# EAGLE design smd_isp adapters (EAGLE 6.1)
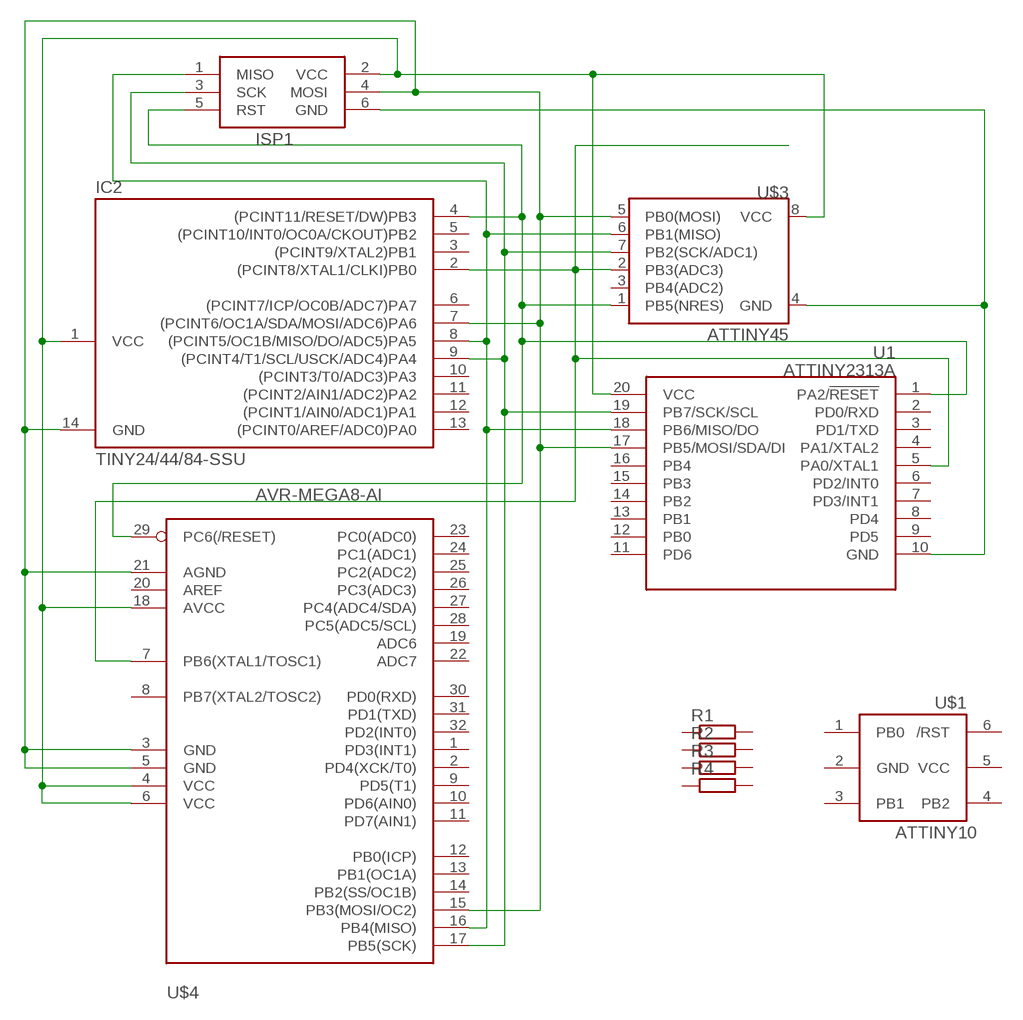
[diagram p0: schematic, sheet 1]

## Parts
IC2  TINY24/44/84-SSU  [SOIC14]
ISP1  AVRISP-6  [AVRISP]
R1  R-EU_R0805  [R0805]
R2  R-EU_R0805  [R0805]
R3  R-EU_R0805  [R0805]
R4  R-EU_R0805  [R0805]
U1  ATTINY2313A  [SOP20W]
U$1  ATTINY10  [SOT23-6]
U$3  ATTINY45  [SO08-EIAJ]
U$4  AVR-MEGA8-AI  [TQFP32-08]

## Nets
MISO: IC2.8((PCINT5/OC1B/MISO/DO/ADC5)PA5) ISP1.1(MISO) U1.18(PB6/MISO/DO) U$3.6(PB1(MISO)) U$4.16(PB4(MISO))
MOSI: IC2.7((PCINT6/OC1A/SDA/MOSI/ADC6)PA6) IC2.14(GND) ISP1.4(MOSI) U1.17(PB5/MOSI/SDA/DI) U$3.5(PB0(MOSI)) U$4.3(GND) U$4.5(GND) U$4.15(PB3(MOSI/OC2)) U$4.21(AGND)
N$1: IC2.2((PCINT8/XTAL1/CLKI)PB0) U1.5(PA0/XTAL1) U$3.2(PB3(ADC3)) U$4.7(PB6(XTAL1/TOSC1))
N$2: ISP1.6(GND) U1.10(GND) U$3.4(GND)
N$3: IC2.1(VCC) ISP1.2(VCC) U1.20(VCC) U$3.8(VCC) U$4.4(VCC) U$4.6(VCC) U$4.18(AVCC)
RST: IC2.4((PCINT11/RESET/DW)PB3) ISP1.5(RST) U1.1(PA2/!RESET) U$3.1(PB5(NRES)) U$4.29(PC6(/RESET))
SCK: IC2.9((PCINT4/T1/SCL/USCK/ADC4)PA4) ISP1.3(SCK) U1.19(PB7/SCK/SCL) U$3.7(PB2(SCK/ADC1)) U$4.17(PB5(SCK))
Unconnected: IC2.3((PCINT9/XTAL2)PB1) IC2.5((PCINT10/INT0/OC0A/CKOUT)PB2) IC2.6((PCINT7/ICP/OC0B/ADC7)PA7) IC2.10((PCINT3/T0/ADC3)PA3) IC2.11((PCINT2/AIN1/ADC2)PA2) IC2.12((PCINT1/AIN0/ADC1)PA1) IC2.13((PCINT0/AREF/ADC0)PA0) R1.1 R1.2 R2.1 R2.2 R3.1 R3.2 R4.1 R4.2 U1.2(PD0/RXD) U1.3(PD1/TXD) U1.4(PA1/XTAL2) U1.6(PD2/INT0) U1.7(PD3/INT1) U1.8(PD4) U1.9(PD5) U1.11(PD6) U1.12(PB0) U1.13(PB1) U1.14(PB2) U1.15(PB3) U1.16(PB4) U$1.1(PB0) U$1.3(PB1) U$1.4(PB2) U$1.6(/RST) U$3.3(PB4(ADC2)) U$4.1(PD3(INT1)) U$4.2(PD4(XCK/T0)) U$4.8(PB7(XTAL2/TOSC2)) U$4.9(PD5(T1)) U$4.10(PD6(AIN0)) U$4.11(PD7(AIN1)) U$4.12(PB0(ICP)) U$4.13(PB1(OC1A)) U$4.14(PB2(SS/OC1B)) U$4.19(ADC6) U$4.20(AREF) U$4.22(ADC7) U$4.23(PC0(ADC0)) U$4.24(PC1(ADC1)) U$4.25(PC2(ADC2)) U$4.26(PC3(ADC3)) U$4.27(PC4(ADC4/SDA)) U$4.28(PC5(ADC5/SCL)) U$4.30(PD0(RXD)) U$4.31(PD1(TXD)) U$4.32(PD2(INT0))

## Power pins joined to a net without a drawn wire
GND: U$1.2(GND)
VCC: U$1.5(VCC)

## Library data of the parts
IC2 = avr-5:TINY24/44/84
ISP1 = adafruit:AVRISP: AVR ISP HEADER Standard 6 pin header for AVR programming
R1-R4 = rcl:R-EU_: RESISTOR, European symbol
U1 = SparkFun-DigitalIC:ATTINY2313A: ATTINY2313A 2kB 20MHz I2C/SPI/UART; PROD_ID: IC-11305
U$1 = adafruit_t10:ATTINY10: ATtiny4/5/9/10 8-bit Microcontroller with 512/1024 Bytes In-System Programmable Flash
U$3 = SparkFun:ATTINY45: Atmel ATTiny45
U$4 = SparkFun-DigitalIC:AVR-MEGA8: MICROCONTROLLER 8 Kbytes FLASH 1 kbytes SRAM 512 bytes EEPROM USART 6-channel 10 bit ADC 2-channel 8 bit ADC

## Board
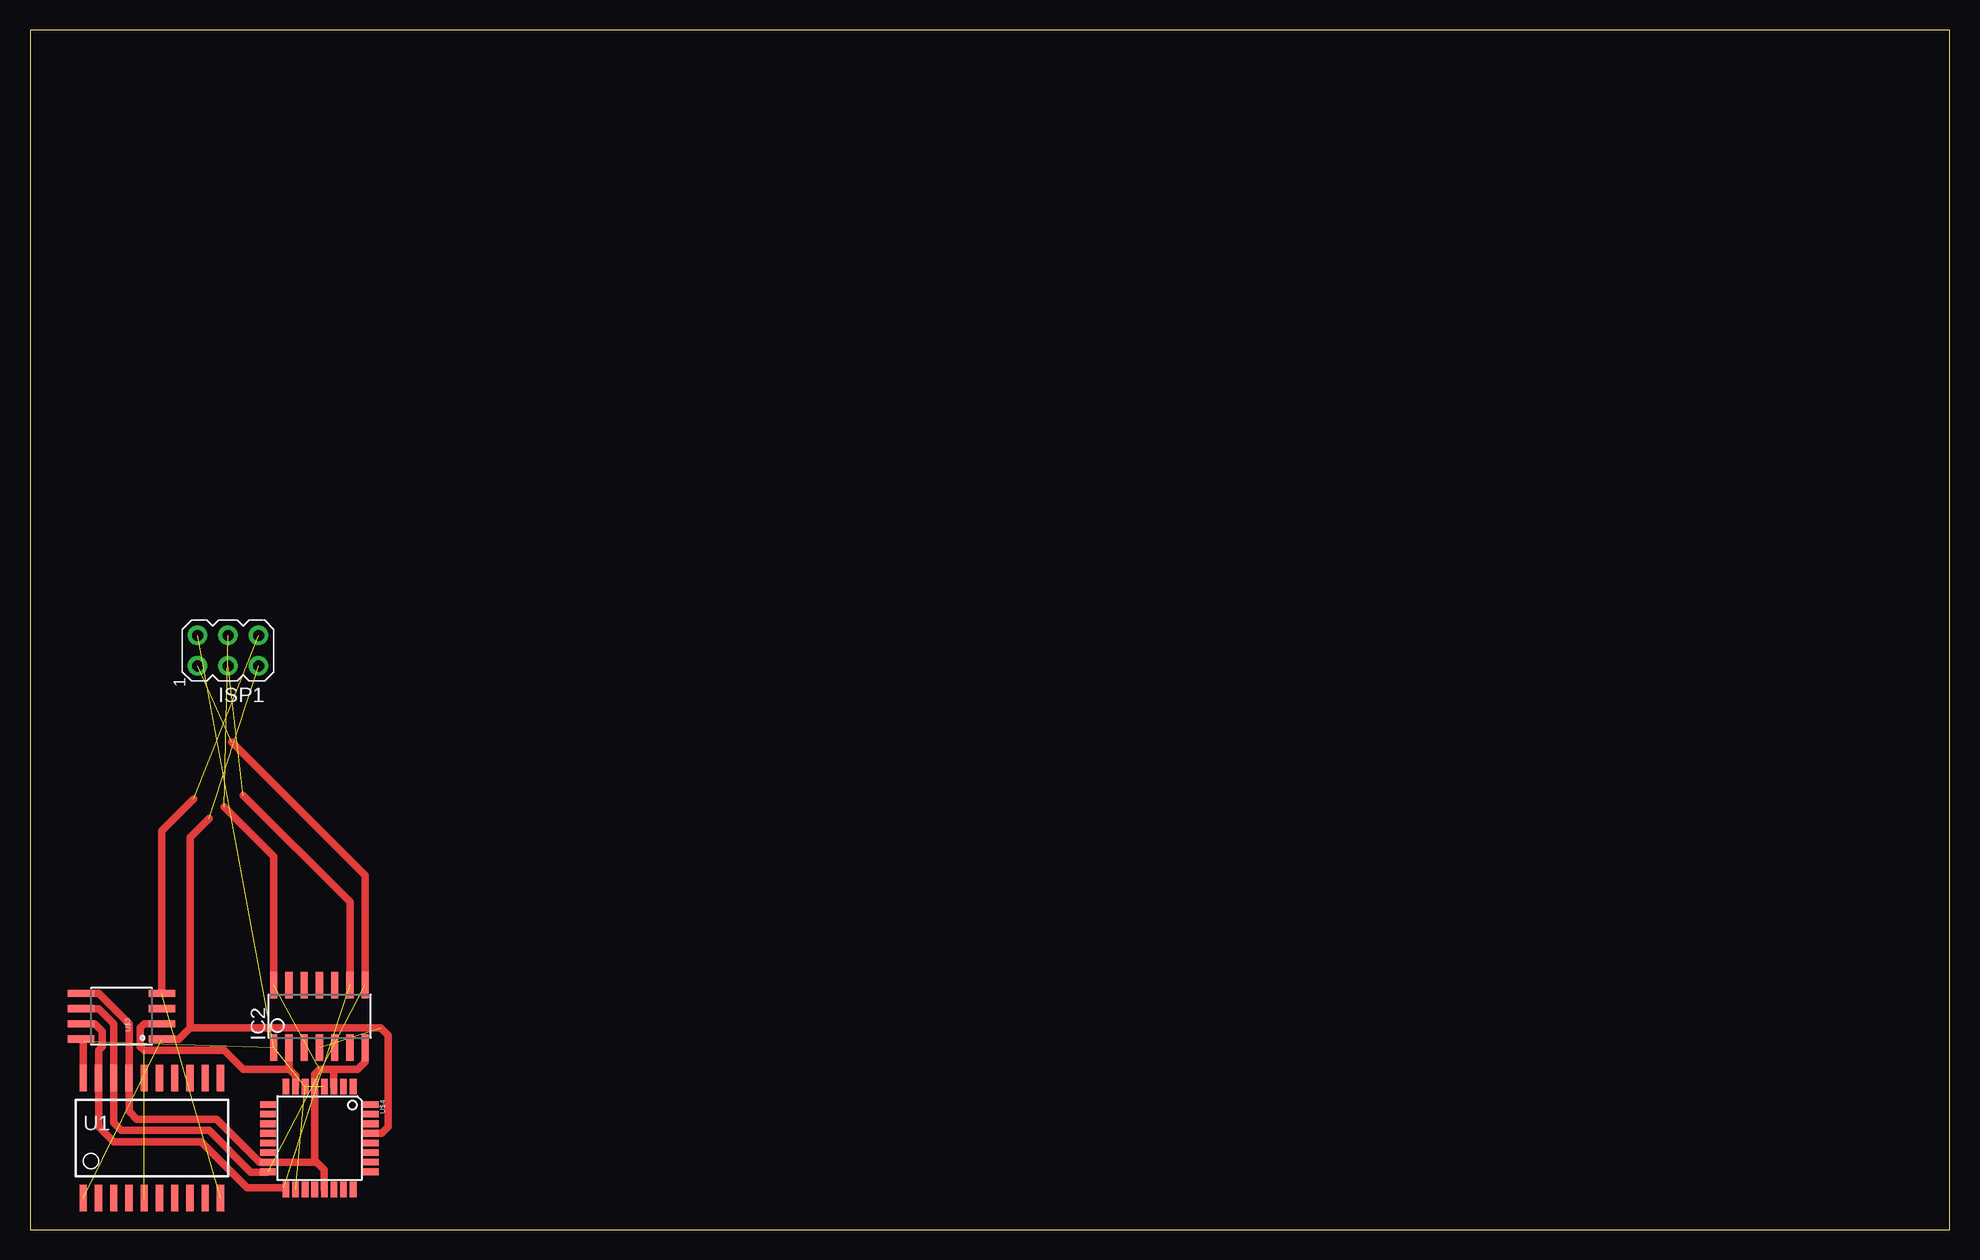
[diagram p1: board, top side]

Size 160 x 100 mm. Coordinates in mm from the lower left corner, seen from the top.
Outline: 0,0 160,0 160,100 0,100 0,0
Copper layers (1*16): Top 0.035mm / dielectric 1.5mm / Bottom 0.035mm
Design rules: minimum track width 10mil, minimum drill 24mil, track to track 8mil, track to pad 8mil, pad to pad 8mil, via to via 8mil, smd to smd 8mil, copper to edge 40mil, drill to drill 8mil, minimum pad ring 10mil, minimum via ring 8mil, stop-mask expansion 4mil, vias tented up to drill 0mil, thermal gap 10mil

### Footprints (pad centres in the part's own frame; a part is rotated, then mirrored left to right if it is on the bottom)
SOIC14 = smd 0.61 x 2.21: 1 -3.81,-2.603; 2 -2.54,-2.603; 3 -1.27,-2.603; 4 0,-2.603; 5 1.27,-2.603; 6 2.54,-2.603; 7 3.81,-2.603; 8 3.81,2.603; 9 2.54,2.603; 10 1.27,2.603; 11 0,2.603; 12 -1.27,2.603; 13 -2.54,2.603; 14 -3.81,2.603
AVRISP = drill 0.9 pad 1.626: 1 -1.27,2.54; 2 1.27,2.54; 3 -1.27,0; 4 1.27,0; 5 -1.27,-2.54; 6 1.27,-2.54
R0805 = smd 1.3 x 1.5: 1 -0.95,0; 2 0.95,0
SOP20W = smd 0.6 x 2.2: 1 -5.715,-5; 2 -4.445,-5; 3 -3.175,-5; 4 -1.905,-5; 5 -0.635,-5; 6 0.635,-5; 7 1.905,-5; 8 3.175,-5; 9 4.445,-5; 10 5.715,-5; 11 5.715,5; 12 4.445,5; 13 3.175,5; 14 1.905,5; 15 0.635,5; 16 -0.635,5; 17 -1.905,5; 18 -3.175,5; 19 -4.445,5; 20 -5.715,5
SOT23-6 = smd 0.55 x 1.2: 1 -0.95,-1.3; 2 0,-1.3; 3 0.95,-1.3; 4 0.95,1.3; 5 0,1.3; 6 -0.95,1.3
SO08-EIAJ = smd 0.61 x 2.21: 1 -1.905,-3.378; 2 -0.635,-3.378; 3 0.635,-3.378; 4 1.905,-3.378; 5 1.905,3.353; 6 0.635,3.353; 7 -0.635,3.353; 8 -1.905,3.353
TQFP32-08 = smd 1.27 x 0.559: 1 -4.293,2.8; 2 -4.293,2; 3 -4.293,1.2; 4 -4.293,0.4; 5 -4.293,-0.4; 6 -4.293,-1.2; 7 -4.293,-2; 8 -4.293,-2.8; 17 4.293,-2.8; 18 4.293,-2; 19 4.293,-1.2; 20 4.293,-0.4; 21 4.293,0.4; 22 4.293,1.2; 23 4.293,2; 24 4.293,2.8 | smd 0.559 x 1.27: 9 -2.8,-4.293; 10 -2,-4.293; 11 -1.2,-4.293; 12 -0.4,-4.293; 13 0.4,-4.293; 14 1.2,-4.293; 15 2,-4.293; 16 2.8,-4.293; 25 2.8,4.293; 26 2,4.293; 27 1.2,4.293; 28 0.4,4.293; 29 -0.4,4.293; 30 -1.2,4.293; 31 -2,4.293; 32 -2.8,4.293

### Placement (x,y rotation side)
IC2  24.13,17.78 0 top
ISP1  16.51,48.26 90 top
R1  -53.34,-3.81 0 top  (outside the outline)
R2  -53.34,-8.89 0 top  (outside the outline)
R3  -53.34,-13.97 0 top  (outside the outline)
R4  -53.34,-19.05 0 top  (outside the outline)
U1  10.16,7.62 0 top
U$1  -20.32,38.1 0 top  (outside the outline)
U$3  7.62,17.78 90 top
U$4  24.13,7.62 270 top

### Tracks (layer width: path | path; a pad name or v marks a point on that pad's centre or on a via)
MISO  (2 unrouted)
  Top 0.61: U$3.6 5.71,18.41 6.99,17.14 U1.18 6.99,8.89 7.62,8.26 14.92,8.26 18.41,4.76 19.78,4.76 U$4.16 | IC2.8 27.94,29.53 16.83,40.64
MOSI  (2 unrouted)
  Top 0.61: IC2.7 27.94,13.97 27.3,13.34 25.4,13.34 | 25.4,13.34 24.13,13.34 23.73,12.94 U$4.5 23.73,5.62 | U$4.3 25.33,13.27 25.4,13.34 | U$3.5 5.71,19.68 8.26,17.14 U1.17 8.26,9.84 8.89,9.21 15.56,9.21 19.14,5.62 U$4.15 23.73,5.62 | 23.73,5.62 23.91,5.62 24.53,5 U$4.21 | IC2.14 20.32,31.11 16.19,35.24
N$1  (1 unrouted)
  Top 0.61: IC2.2 21.59,13.34 | 21.59,13.34 22.13,12.79 U$4.7 | U$3.2 9.53,17.14 9.21,16.83 9.21,15.24 9.53,14.92 16.19,14.92 17.78,13.34 21.59,13.34
N$2  (2 unrouted)
  Top 0.61: U$3.4 11,33.22 13.65,35.88
N$3  (5 unrouted)
  Top 0.61: U1.20 4.45,15.7 U$3.8
RST  (3 unrouted)
  Top 0.61: U$4.29 29.29,8.02 29.84,8.57 29.84,16.19 29.21,16.83 13.34,16.83 | 13.34,16.83 12.38,15.88 U$3.1 | 13.34,16.83 13.34,32.7 14.92,34.29
SCK  (2 unrouted)
  Top 0.61: U$3.7 5.4,17.14 6.03,16.51 6.03,15.24 5.71,14.92 U1.19 5.71,8.57 6.99,7.3 14.29,7.3 18.1,3.49 21.16,3.49 U$4.17 | IC2.9 26.67,27.3 17.78,36.2